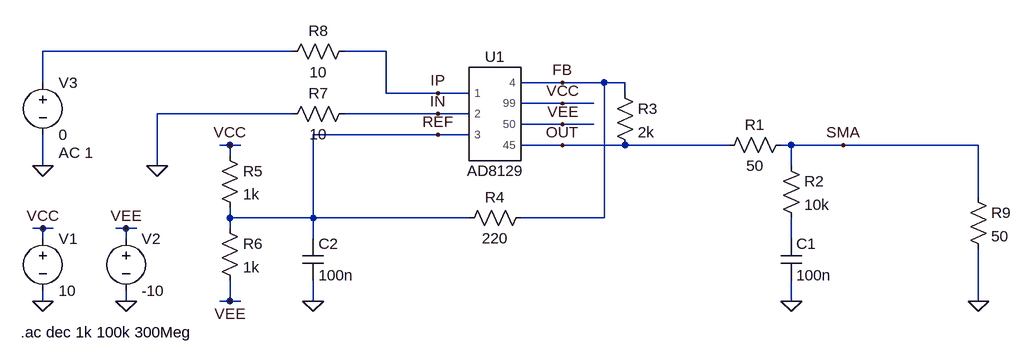
[diagram p0: schematic Simulation.asc]
Simulation.asc, the LTspice schematic file:
Version 4
SHEET 1 1032 740
WIRE -80 208 -464 208
WIRE 64 208 0 208
WIRE -464 256 -464 208
WIRE 336 256 272 256
WIRE 400 256 336 256
WIRE 432 256 400 256
WIRE 64 272 64 208
WIRE 144 272 64 272
WIRE 192 272 144 272
WIRE 432 272 432 256
WIRE 336 288 272 288
WIRE 384 288 336 288
WIRE -80 304 -288 304
WIRE 144 304 0 304
WIRE 192 304 144 304
WIRE 336 320 272 320
WIRE 384 320 336 320
WIRE 144 336 -48 336
WIRE 192 336 144 336
WIRE -176 352 -192 352
WIRE -160 352 -176 352
WIRE 336 352 272 352
WIRE 432 352 336 352
WIRE 592 352 432 352
WIRE 688 352 672 352
WIRE 768 352 688 352
WIRE 976 352 768 352
WIRE -176 368 -176 352
WIRE -464 384 -464 336
WIRE -288 384 -288 304
WIRE 688 384 688 352
WIRE 976 432 976 352
WIRE -176 464 -176 448
WIRE -48 464 -48 336
WIRE -48 464 -176 464
WIRE 192 464 -48 464
WIRE 400 464 400 256
WIRE 400 464 272 464
WIRE -464 480 -480 480
WIRE -448 480 -464 480
WIRE -336 480 -352 480
WIRE -320 480 -336 480
WIRE -176 480 -176 464
WIRE -464 496 -464 480
WIRE -336 496 -336 480
WIRE -48 496 -48 464
WIRE 688 496 688 464
WIRE -464 592 -464 576
WIRE -336 592 -336 576
WIRE -176 592 -176 560
WIRE -176 592 -192 592
WIRE -160 592 -176 592
WIRE -48 592 -48 560
WIRE 688 592 688 560
WIRE 976 592 976 512
FLAG -464 592 0
FLAG -336 592 0
FLAG -464 480 VCC
FLAG -336 480 VEE
FLAG 144 272 IP
FLAG 144 304 IN
FLAG 144 336 REF
FLAG 336 288 VCC
FLAG 336 320 VEE
FLAG 336 352 OUT
FLAG 336 256 FB
FLAG 768 352 SMA
FLAG 688 592 0
FLAG -48 592 0
FLAG -176 352 VCC
FLAG -176 592 VEE
FLAG -464 384 0
FLAG 976 592 0
FLAG -288 384 0
SYMBOL AD8129 224 304 R0
SYMATTR InstName U1
SYMBOL voltage -464 480 R0
WINDOW 123 0 0 Left 0
WINDOW 39 0 0 Left 0
SYMATTR InstName V1
SYMATTR Value 10
SYMBOL voltage -336 480 R0
WINDOW 123 0 0 Left 0
WINDOW 39 0 0 Left 0
SYMATTR InstName V2
SYMATTR Value -10
SYMBOL res 688 336 R90
WINDOW 0 0 56 VBottom 2
WINDOW 3 32 56 VTop 2
SYMATTR InstName R1
SYMATTR Value 50
SYMBOL res 672 368 R0
SYMATTR InstName R2
SYMATTR Value 10k
SYMBOL cap 672 496 R0
SYMATTR InstName C1
SYMATTR Value 100n
SYMBOL res 416 256 R0
SYMATTR InstName R3
SYMATTR Value 2k
SYMBOL res 288 448 R90
WINDOW 0 0 56 VBottom 2
WINDOW 3 32 56 VTop 2
SYMATTR InstName R4
SYMATTR Value 220
SYMBOL cap -64 496 R0
SYMATTR InstName C2
SYMATTR Value 100n
SYMBOL res -192 352 R0
SYMATTR InstName R5
SYMATTR Value 1k
SYMBOL res -192 464 R0
SYMATTR InstName R6
SYMATTR Value 1k
SYMBOL res 16 288 R90
WINDOW 0 0 56 VBottom 2
WINDOW 3 32 56 VTop 2
SYMATTR InstName R7
SYMATTR Value 10
SYMBOL res 16 192 R90
WINDOW 0 0 56 VBottom 2
WINDOW 3 32 56 VTop 2
SYMATTR InstName R8
SYMATTR Value 10
SYMBOL voltage -464 240 R0
WINDOW 123 24 124 Left 2
WINDOW 39 0 0 Left 0
SYMATTR InstName V3
SYMATTR Value 0
SYMATTR Value2 AC 1
SYMBOL res 960 416 R0
SYMATTR InstName R9
SYMATTR Value 50
TEXT -498 640 Left 2 !.ac dec 1k 100k 300Meg

The netlist it stands for:
* Simulation.asc
XU1 IP IN REF FB VCC VEE OUT AD8129  ; pins 1 2 3 4 99 50 45
V1 VCC 0 10
V2 VEE 0 -10
R1 SMA OUT 50
R2 SMA N002 10k
C1 N002 0 100n
R3 FB OUT 2k
R4 FB REF 220
C2 REF 0 100n
R5 VCC REF 1k
R6 REF VEE 1k
R7 IN 0 10
R8 IP N001 10
V3 N001 0 0 AC 1
R9 SMA 0 50
.ac dec 1k 100k 300Meg
.lib C:\Users\juddf\Documents\DiffProbe\LTSpice\ad8129.cir
.backanno
.end